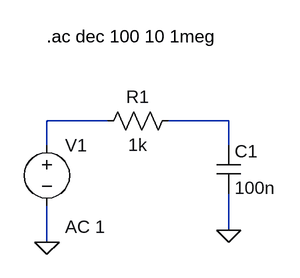
[diagram p0: schematic LowPassFilter.asc]
LowPassFilter.asc, the LTspice schematic file:
Version 4
SHEET 1 880 680
WIRE 192 256 112 256
WIRE 352 256 272 256
WIRE 112 288 112 256
WIRE 352 288 352 256
WIRE 352 400 352 352
WIRE 112 416 112 368
FLAG 112 416 0
FLAG 352 400 0
SYMBOL voltage 112 272 R0
WINDOW 123 24 124 Left 2
WINDOW 39 0 0 Left 0
SYMATTR InstName V1
SYMATTR Value ""
SYMATTR Value2 AC 1
SYMBOL res 288 240 R90
WINDOW 0 0 56 VBottom 2
WINDOW 3 32 56 VTop 2
SYMATTR InstName R1
SYMATTR Value 1k
SYMBOL cap 336 288 R0
SYMATTR InstName C1
SYMATTR Value 100n
TEXT 112 144 Left 2 !.ac dec 100 10 1meg

The netlist it stands for:
* LowPassFilter.asc
V1 N001 0 AC 1
R1 N002 N001 1k
C1 N002 0 100n
.ac dec 100 10 1meg
.backanno
.end